# Altium schematic sheet Power_Section.SchDoc
size A4; SheetNumber: 5; SheetTotal: 10
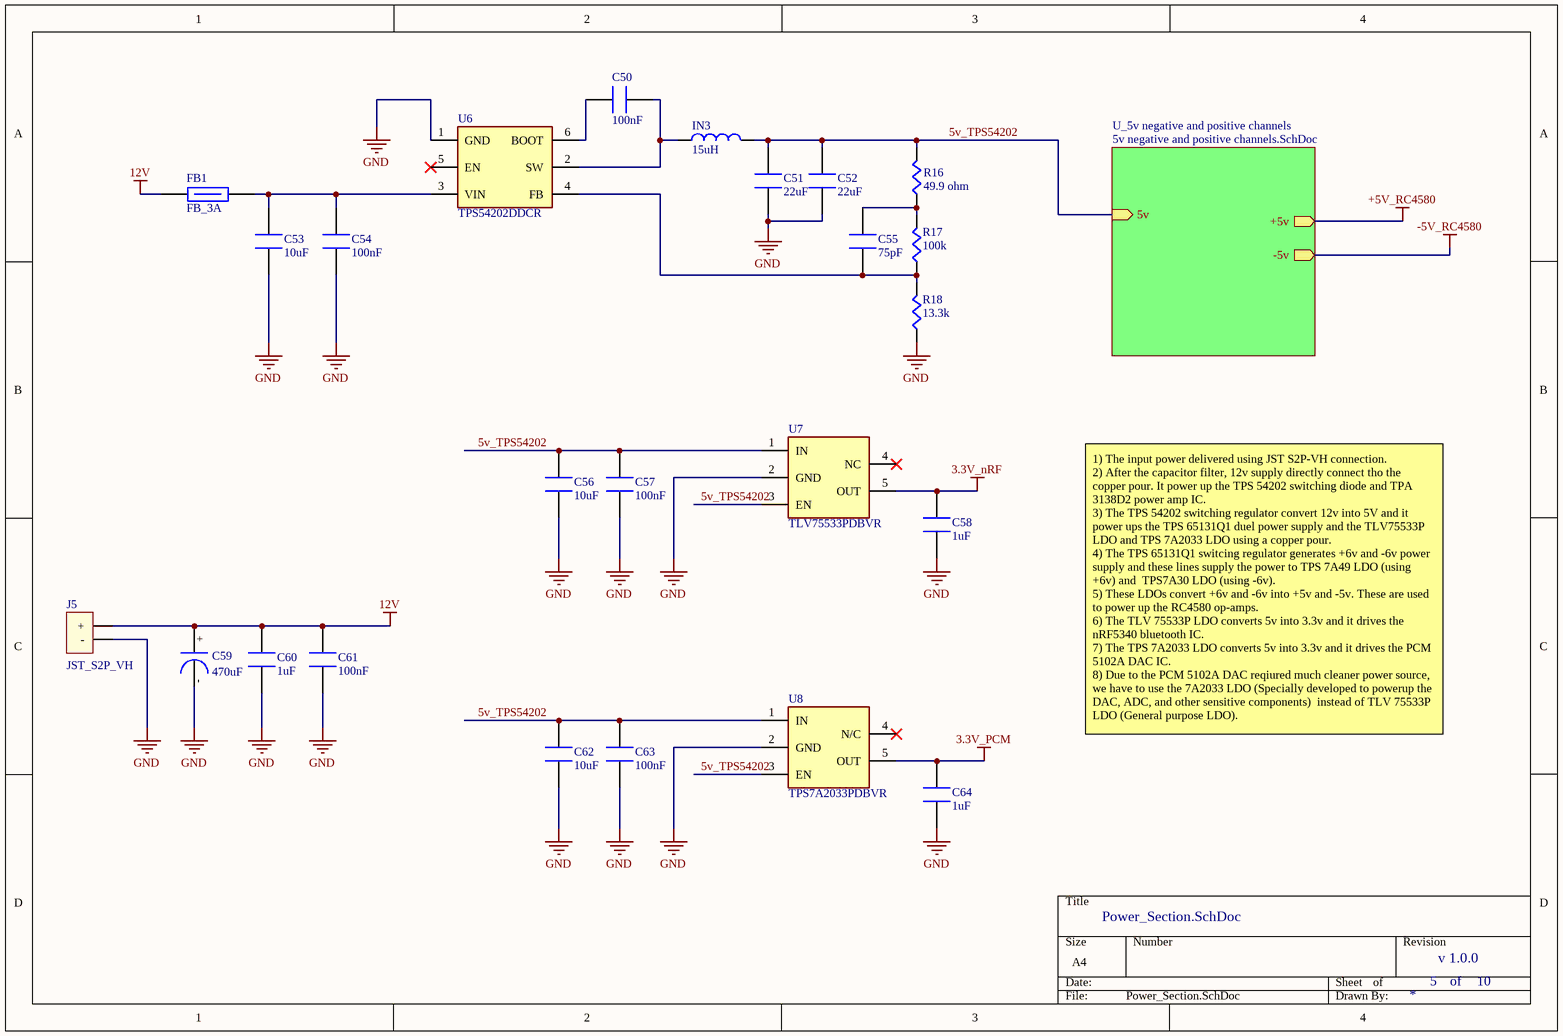
[diagram p0: Power_Section.SchDoc]

## Parts
C50  100nF  [CAPC0603X8N]
C51  22uF  [CAPC1210X25N]
C52  22uF  [CAPC1210X25N]
C53  10uF  [CAPC0805X14N]
C54  100nF  [CAPC0603X8N]
C55  75pF  [CAPC0603X8N]
C56  10uF  [CAPC0805X14N]
C57  100nF  [CAPC0603X8N]
C58  1uF  [CAP0805X13N]
C59  470uF  [CAPD10XL11.1X10.2M]
C60  1uF  [CAP0805X13N]
C61  100nF  [CAPC0603X8N]
C62  10uF  [CAPC0805X14N]
C63  100nF  [CAPC0603X8N]
C64  1uF  [CAP0805X13N]
FB1  FB_3A  [FB0603X08N]
IN3  15uH  [INDM7266X30N]
J5  JST_S2P_VH  [JST_S2P_VH]
R16  49.9 ohm  [RECS0603X45N]
R17  100k  [RECS0603X45N]
R18  13.3k  [RECS0603X45N]
U6  TPS54202DDCR  [TPS54202DDCR]
U7  TLV75533PDBVR  [SOT95P280X145-5N]
U8  TPS7A2033PDBVR  [SOT95P280X145-5N]

## Sub-sheets
U_5v negative and positive channels = 5v negative and positive channels.SchDoc: +5v (out), -5v (out), 5v (in)

## Nets
3.3V_nRF: C58.2 U7.5(OUT)
3.3V_PCM: C64.2 U8.5(OUT)
12V: C59.1 C60.2 C61.2 FB1.1 J5.1(+)
+5V_RC4580: sheet U_5v negative and positive channels/+5v
-5V_RC4580: sheet U_5v negative and positive channels/-5v
GND: C51.1 C52.1 C53.1 C54.1 C56.1 C57.1 C58.1 C59.2 C60.1 C61.1 C62.1 C63.1 C64.1 J5.2(-) R18.1 U6.1(GND) U7.2(GND) U8.2(GND)
5v_TPS54202: C51.2 C52.2 C56.2 C57.2 C62.2 C63.2 IN3.2 R16.2 U7.1(IN) U7.3(EN) U8.1(IN) U8.3(EN) ; sheet U_5v negative and positive channels/5v
NetC50_1: C50.1 IN3.1 U6.2(SW)
NetC50_2: C50.2 U6.6(BOOT)
NetC53_2: C53.2 C54.2 FB1.2 U6.3(VIN)
NetC55_1: C55.1 R17.1 R18.2 U6.4(FB)
NetC55_2: C55.2 R16.1 R17.2

Not connected (* = marked no-connect by the designer): U6 5(EN)*; U7 4(NC)*; U8 4(N/C)*

## Notes on the sheet
- 1) The input power delivered using JST S2P-VH connection.
  2) After the capacitor filter, 12v supply directly connect tho the copper pour. It power up the TPS 54202 switching diode and TPA 3138D2 power amp IC.
  3) The TPS 54202 switching regulator convert 12v into 5V and it power ups the TPS 65131Q1 duel power supply and the TLV75533P LDO and TPS 7A2033 LDO using a copper pour.
  4) The TPS 65131Q1 switcing regulator generates +6v and -6v power supply and these lines supply the power to TPS 7A49 LDO (using +6v) and  TPS7A30 LDO (using -6v).
  5) These LDOs convert +6v and -6v into +5v and -5v. These are used to power up the RC4580 op-amps.
  6) The TLV 75533P LDO converts 5v into 3.3v and it drives the nRF5340 bluetooth IC.
  7) The TPS 7A2033 LDO converts 5v into 3.3v and it drives the PCM 5102A DAC IC.
  8) Due to the PCM 5102A DAC reqiured much cleaner power source, we have to use the 7A2033 LDO (Specially developed to powerup the DAC, ADC, and other sensitive components)  instead of TLV 75533P LDO (General purpose LDO).
- v 1.0.0
- of
- (in symbol CPD10XL10.2_470uF_ALUM) +; -

## Library data of the parts
C50 C54 C57 C61 C63 = CC0603_100nF_X7R: C14663, CC0603KRX7R9BB104, 100nF 50V X7R ±10% 0603 Multilayer Ceramic Capacitors MLCC - SMD/SMT ROHS; Supplier 1: element14 APAC; Supplier Part Number 1: CC0603KRX7R9BB104
C51 C52 = CC1210_22uF_X7R: C309062, CL32B226KAJNNNE, 22uF 25V X7R ±10% 1210 Multilayer Ceramic Capacitors MLCC - SMD/SMT ROHS; Supplier 1: Avnet; Supplier Part Number 1: CL32B226KAJNNNE
C53 C56 C62 = CC0805_10uF_X7R: C95841, CL21B106KOQNNNE, 10uF 16V X7R ±10% 0805 Multilayer Ceramic Capacitors MLCC - SMD/SMT ROHS; Supplier 1: Avnet; Supplier Part Number 1: CL21B106KOQNNNE
C55 = CC0603_75pF_NPO: C282074, CC0603JRNPO9BN750, 50V 75pF NP0 ±5% 0603 Multilayer Ceramic Capacitors MLCC - SMD/SMT ROHS; Supplier 1: element14 APAC; Supplier Part Number 1: CC0603JRNPO9BN750
C58 C60 C64 = CC0805_1uF_X7R: C28323, CL21B105KBFNNNE, 1uF 50V X7R ±10% 0805 Multilayer Ceramic Capacitors MLCC - SMD/SMT ROHS; Supplier 1: Future Electronics; Supplier Part Number 1: CL21B105KBFNNNE
C59 = CPD10XL10.2_470uF_ALUM: C3350, RVT1V471M1010, -55℃~+105℃ 10.2mm 10mm 2000hrs@105℃ 35V 470uF ±20% SMD,D10xL10.2mm Aluminum Electrolytic Capacitors - SMD ROHS; Supplier 1: UnikeyIC; Supplier Part Number 1: RVT1V471M1010
FB1 = FB0603_3A: C107332, MPZ1608S101ATAH0, -55℃~+125℃ 1 100Ω@100MHz 30mΩ 3A ±25% 0603 Ferrite Beads ROHS; Supplier 1: element14 APAC; Supplier Part Number 1: MPZ1608S101ATAH0
IN3 = IN7266_15uH_3A: C5189959, CYA0630-15UH, 15uH 3.8A 3A 98mΩ ±20% SMD,7.2x6.6mm Inductors (SMD) ROHS; Supplier 1: LCSC; Supplier Part Number 1: C5189959
J5 = JST_S2P_VH: C160355, S2P-VH(LF)(SN), -25℃~+85℃ 1 10A 13.9mm 1x2P 2 250V 2P 3.96mm 7.86mm Brass PA66 Right Angle Tin UL94V-0 VH White 弯插,P=3.96mm Wire To Board Connector ROHS; Supplier 1: CoreStaff; Supplier Part Number 1: ST73514420
R16 = RESC0603_49.9_THIN: C23185, 0603WAF499JT5E, -55℃~+155℃ 100mW 49.9Ω 75V Thick Film Resistor ±1% ±100ppm/℃ 0603 Chip Resistor - Surface Mount ROHS; Supplier 1: TME; Supplier Part Number 1: 0603WAF499JT5E
R17 = RESC0603_100K_THIN: C116674, AC0603FR-07100KL, -55℃~+155℃ 100kΩ 100mW 75V Thick Film Resistor ±1% ±100ppm/℃ 0603 Chip Resistor - Surface Mount ROHS; Supplier 1: element14 APAC; Supplier Part Number 1: AC0603FR-07100KL
R18 = REC0603_13.3K_THICK: C185373, RC0603FR-0713K3L, -55℃~+155℃ 100mW 13.3kΩ 75V Thick Film Resistor ±1% ±100ppm/℃ 0603 Chip Resistor - Surface Mount ROHS; Supplier 1: Future Electronics; Supplier Part Number 1: RC0603FR-0713K3L
U6 = TPS54202DDCR: C191884, TPS54202DDCR, -40℃~+125℃@(TJ) 1 2A 4.5V~28V 45uA 500kHz Adjustable Buck Buck Built-in Yes SOT-23-6 DC-DC Converters ROHS; Manufacturer_Name: Texas Instruments; Datasheet Link: http://www.ti.com/lit/gpn/tps54202; Height: 1.1mm; Manufacturer_Part_Number: TPS54202DDCR; Mouser Part Number: 595-TPS54202DDCR; Mouser Price/Stock: https://www.mouser.co.uk/ProductDetail/Texas-Instruments/TPS54202DDCR?qs=uP22XH7NdCsJtN%2Fq54jCtQ%3D%3D; Arrow Part Number: TPS54202DDCR; Arrow Price/Stock: https://www.arrow.com/en/products/tps54202ddcr/texas-instruments?utm_currency=USD&region=nac; Supplier 1: DigiKey; Supplier Part Number 1: 296-TPS54202DDCRCT-ND
U7 = TLV75533PDBVR: C404027, TLV75533PDBVR, -40℃~+125℃@(Tj) 1 238mV@(500mA) 25uA 3.3V 46dB@(100kHz) 5.5V 500mA 71.5uVrms Fixed Over Current Protection、Thermal Shutdown、Input undervoltage protection Positive SOT-23-5 Voltage Regulators - Linear, Low Drop Out (LDO) Regulators ROHS; Manufacturer_Name: Texas Instruments; Datasheet Link: http://www.ti.com/lit/gpn/tlv755p; Height: 1.45mm; Manufacturer_Part_Number: TLV75533PDBVR; Mouser Part Number: 595-TLV75533PDBVR; Mouser Price/Stock: https://www.mouser.co.uk/ProductDetail/Texas-Instruments/TLV75533PDBVR?qs=55YtniHzbhAKEwqeO2xJXQ%3D%3D; Arrow Part Number: TLV75533PDBVR; Arrow Price/Stock: https://www.arrow.com/en/products/tlv75533pdbvr/texas-instruments?utm_currency=USD&region=nac; Supplier 1: DigiKey; Supplier Part Number 1: 296-50411-1-ND
U8 = TPS7A2033PDBVR: C2862740, TPS7A2033PDBVR, -40℃~+125℃@(Tj) 1 10uVrms 140mV@(300mA) 3.3V 300mA 65dB@(100kHz) 6V 8.5uA Fixed Over Current Protection、Enable Positive SOT-23-5 Voltage Regulators - Linear, Low Drop Out (LDO) Regulators ROHS; Manufacturer_Name: Texas Instruments; Datasheet Link: https://www.ti.com/lit/ds/symlink/tps7a20.pdf?ts=1603960048570&ref_url=https%253A%252F%252Fwww.ti.com%252Fstore%252Fti%252Fen%252Fp%252Fproduct%252F%253Fp%253DPTPS7A2045PDQNR%2526keyMatch%253DPTPS7A2045PDQNR%2526tisearch%253DSearch-EN-everything; Height: 1.45mm; Manufacturer_Part_Number: TPS7A2033PDBVR; Mouser Part Number: 595-TPS7A2033PDBVR; Mouser Price/Stock: https://www.mouser.co.uk/ProductDetail/Texas-Instruments/TPS7A2033PDBVR?qs=hd1VzrDQEGjk%2FOBnRfKB4A%3D%3D; Arrow Part Number: TPS7A2033PDBVR; Arrow Price/Stock: https://www.arrow.com/en/products/tps7a2033pdbvr/texas-instruments.html?utm_currency=USD&region=nac; Supplier 1: DigiKey; Supplier Part Number 1: 296-TPS7A2033PDBVRCT-ND